# Altium schematic sheet IoT_Greenhouse V1.0 A - Inputs.SchDoc
size A4; DrawnBy: Elio F; Engineer: Elio F; Revision: A; SheetNumber: 4; SheetTotal: 5; Sheet Title: Inputs
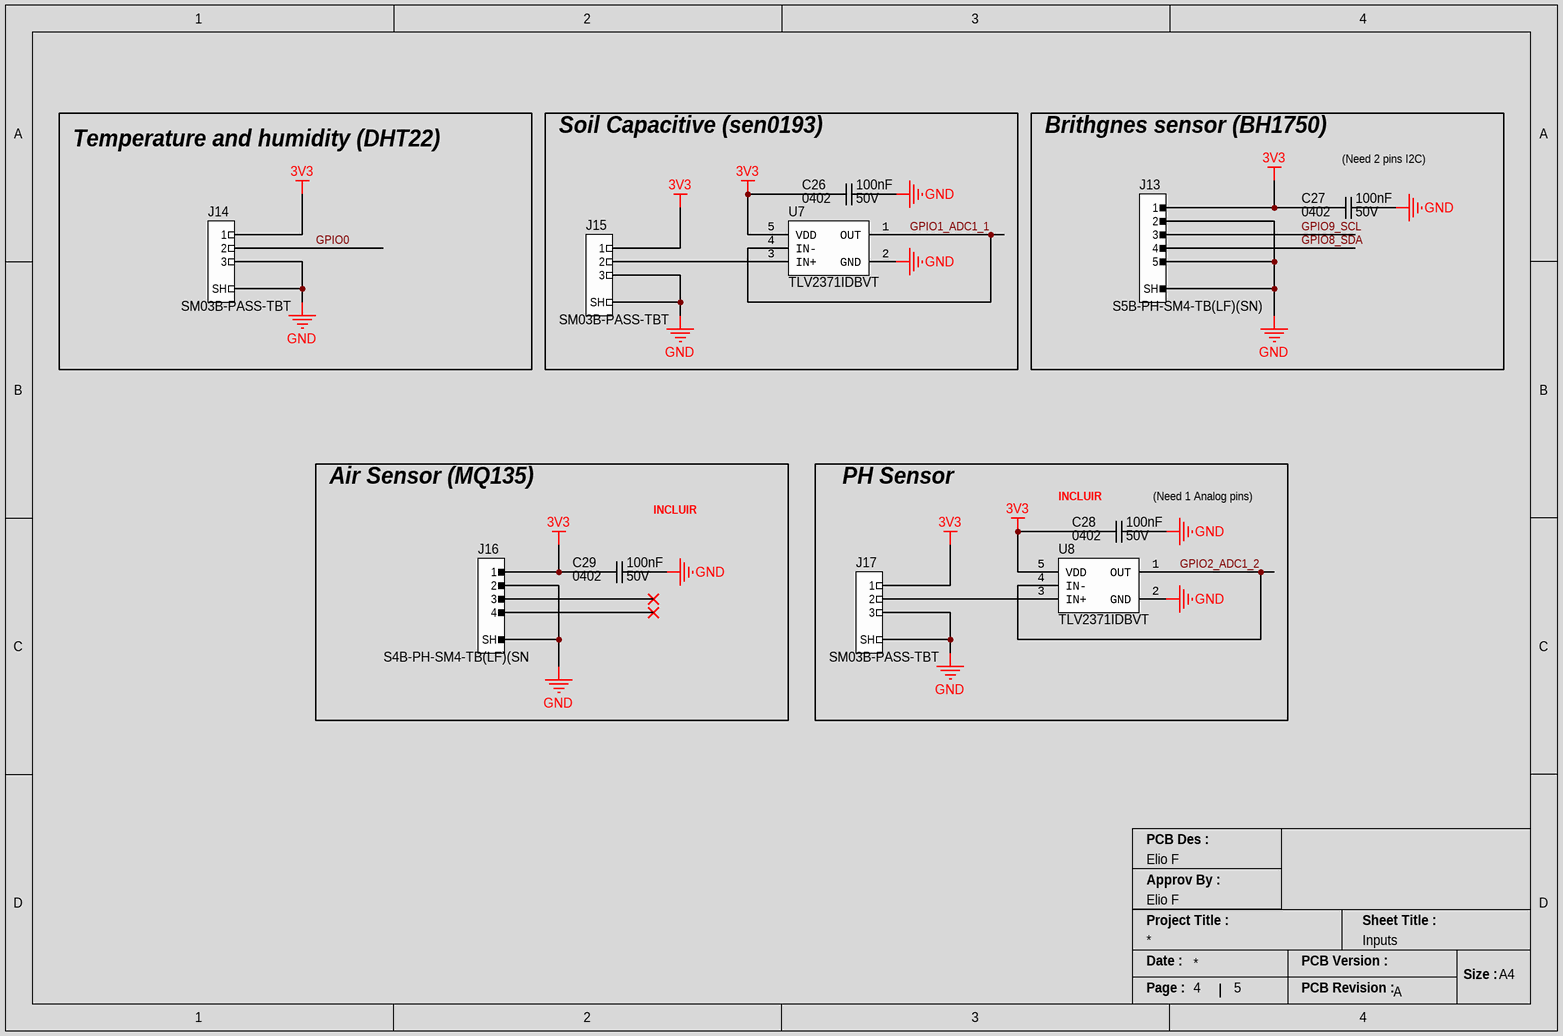
[diagram p0: IoT_Greenhouse V1.0 A - Inputs.SchDoc]

## Parts
C26  Voltage Rating: 50V  Capacitance: 100nF  Case/Package: 0402  [CAP_0402_CAPC1005X05N]  (hidden comment: GRM155R71H104KE14D)
C27  Voltage Rating: 50V  Capacitance: 100nF  Case/Package: 0402  [CAP_0402_CAPC1005X05N]  (hidden comment: GRM155R71H104KE14D)
C28  Voltage Rating: 50V  Capacitance: 100nF  Case/Package: 0402  [CAP_0402_CAPC1005X05N]  (hidden comment: GRM155R71H104KE14D)
C29  Voltage Rating: 50V  Capacitance: 100nF  Case/Package: 0402  [CAP_0402_CAPC1005X05N]  (hidden comment: GRM155R71H104KE14D)
J13  S5B-PH-SM4-TB(LF)(SN)  [CONN_JST_S5B-PH-SM4-TB_LF_SN_0]
J14  SM03B-PASS-TBT  [CONN_JST_SM03B-PASS-TBT_LF_SN_MFG]
J15  SM03B-PASS-TBT  [CONN_JST_SM03B-PASS-TBT_LF_SN_MFG]
J16  S4B-PH-SM4-TB(LF)(SN  [CONN_JST_S4B-PH-SM4-TB_LF_SN_0]
J17  SM03B-PASS-TBT  [CONN_JST_SM03B-PASS-TBT_LF_SN_MFG]
U7  TLV2371IDBVT  [IC_AMP_OP_SOT95P280X145-5N]
U8  TLV2371IDBVT  [IC_AMP_OP_SOT95P280X145-5N]

## Blocks framed on the sheet
Temperature and humidity (DHT22): J14
Soil Capacitive (sen0193): C26 J15 U7
Brithgnes sensor (BH1750): C27 J13
Air Sensor (MQ135): C29 J16
PH Sensor: C28 J17 U8

## Nets
3V3: C26.2 C27.2 C28.2 C29.2 J13.1 J14.1 J15.1 J16.1 J17.1 U7.5(VDD) U8.5(VDD)
GND: C26.1 C27.1 C28.1 C29.1 J13.0(SH) J13.2 J13.5 J14.3 J14.SH J15.3 J15.SH J16.0(SH) J16.2 J17.3 J17.SH U7.2(GND) U8.2(GND)
GPIO0: J14.2
GPIO1_ADC1_1: U7.1(OUT) U7.4(IN-)
GPIO2_ADC1_2: U8.1(OUT) U8.4(IN-)
GPIO8_SDA: J13.4
GPIO9_SCL: J13.3
NetJ15_2: J15.2 U7.3(IN+)
NetJ17_2: J17.2 U8.3(IN+)

Not connected (* = marked no-connect by the designer): J16 3* 4*

## Notes on the sheet
- (near C27) (Need 2 pins I2C)
- INCLUIR
- (near C28) INCLUIR
- (near C28) (Need 1 Analog pins)
- PCB Des :
- Approv By :
- Project Title :
- Sheet Title :
- Date :
- PCB Version :
- Size :
- A4
- Page :
- PCB Revision :

## Library data of the parts
C26-C29 = CAP_100NF_50V_X7R_0402: Multilayer Ceramic Capacitor, 0.1 uF, 16 V, ± 10%, X7R, 0402 [1005 Metric]; Manufacturer: Murata; Dissipation Factor: 0.025%; Temperature Coefficient: 30ppm/°C; Supplier 1: DigiKey; Manufacturer Part Number: GRM155R71H104KE14D; RoHS: Yes; Category: Ceramic Capacitors; Stock 1: 13730790; Pricing 1: 1=0.1, 10=0.023, 50=0.0132, 100=0.0102, 500=0.00768, 1000=0.00603, 2500=0.00548, 5000=0.00504 (USD); Mount: Surface Mount; Number of Pins: 2NUMBER; Case Code (Metric): 1005; Material: Ceramic; Case Code (Imperial): 0402; Weight: 0.000212oz; Dielectric Material: Ceramic; Min Operating Temperature: -55°C; Max Operating Temperature: 125°C; Packaging: Tape and Reel; Package Quantity: 10000; Series: GRM; Tolerance: 10%; Dielectric: X7R; Termination: SMD/SMT; Voltage: 50V; Voltage Rating (DC): 50V; Construction: Flat; Length: 1mm; Width: 0.5mm; Height: 0.5mm; Depth: 0.5mm; Thickness: 0.022inch; Reach SVHC Compliant: No; RoHS Compliant: Yes; Lead Free: 5697LeadFree; ComponentLink1URL: http://www.farnell.com/datasheets/2079156.pdf?src-supplier=Farnell; ComponentLink1Description: http://www.farnell.com/datasheets/2079156.pdf?src-supplier=Farnell; ComponentLink2URL: http://www.mouser.com/ds/2/281/c02e-2905.pdf?src-supplier=Mouser; ComponentLink2Description: http://www.mouser.com/ds/2/281/c02e-2905.pdf?src-supplier=Mouser; ComponentLink3URL: http://www.farnell.com/datasheets/2079156.pdf?src-supplier=Newark; ComponentLink3Description: http://www.farnell.com/datasheets/2079156.pdf?src-supplier=Newark; ComponentLink4URL: https://datasheet.octopart.com/GRM155R71H104KE14D-Murata-datasheet-22122223.pdf?src-supplier=Future+Electronics; ComponentLink4Description: https://datasheet.octopart.com/GRM155R71H104KE14D-Murata-datasheet-22122223.pdf?src-supplier=Future+Electronics; ComponentLink5URL: https://search.murata.co.jp/Ceramy/image/img/A01X/G101/ENG/GRM155R71H104KE14-01.pdf?src-supplier=Digi-Key; ComponentLink5Description: https://search.murata.co.jp/Ceramy/image/img/A01X/G101/ENG/GRM155R71H104KE14-01.pdf?src-supplier=Digi-Key; ComponentLink6URL: http://psearch.en.murata.com/capacitor/product/GRM155R71H104KE14%23.pdf?src-supplier=Avnet; ComponentLink6Description: http://psearch.en.murata.com/capacitor/product/GRM155R71H104KE14%23.pdf?src-supplier=Avnet; ComponentLink7URL: https://datasheet.octopart.com/GRM155R71H104KE14D-Murata-datasheet-66077078.pdf?src-supplier=Element14; ComponentLink7Description: https://datasheet.octopart.com/GRM155R71H104KE14D-Murata-datasheet-66077078.pdf?src-supplier=Element14; Supplier Part Number 1: 490-10700-6-ND; Supplier 2: Digikey; Stock 2: 3706055; Pricing 2: 1=0.1, 10=0.037, 50=0.021, 100=0.0162, 500=0.01224, 1000=0.00961, 2500=0.00874, 5000=0.00804 (USD); Halogen Free: 5694HalogenFree; ComponentLink8URL: http://www.mouser.com/ds/2/447/UPY-GPHC_X5R_4V-to-50V_25-1131599.pdf?src-supplier=Mouser; ComponentLink8Description: http://www.mouser.com/ds/2/447/UPY-GPHC_X5R_4V-to-50V_25-1131599.pdf?src-supplier=Mouser; ComponentLink9URL: https://datasheet.octopart.com/CC0402KRX5R8BB104-Yageo-datasheet-137700082.pdf?src-supplier=Future+Electronics; ComponentLink9Description: https://datasheet.octopart.com/CC0402KRX5R8BB104-Yageo-datasheet-137700082.pdf?src-supplier=Future+Electronics; ComponentLink10URL: http://www.yageo.com/documents/recent/UPY-GPHC_X5R_4V-to-50V_25.pdf?src-supplier=Digikey; ComponentLink10Description: http://www.yageo.com/documents/recent/UPY-GPHC_X5R_4V-to-50V_25.pdf?src-supplier=Digikey; ComponentLink11URL: https://datasheet.octopart.com/CC0402KRX5R8BB104-Yageo-datasheet-140260304.pdf?src-supplier=Newark; ComponentLink11Description: https://datasheet.octopart.com/CC0402KRX5R8BB104-Yageo-datasheet-140260304.pdf?src-supplier=Newark; ComponentLink12URL: https://datasheet.octopart.com/CC0402KRX5R8BB104-Yageo-datasheet-170350636.pdf?src-supplier=Future+Electronics; ComponentLink12Description: https://datasheet.octopart.com/CC0402KRX5R8BB104-Yageo-datasheet-170350636.pdf?src-supplier=Future+Electronics; ComponentLink13URL: http://www.yageo.com/documents/recent/UPY-GPHC_X5R_4V-to-50V-16.pdf?src-supplier=Future+Electronics; ComponentLink13Description: http://www.yageo.com/documents/recent/UPY-GPHC_X5R_4V-to-50V-16.pdf?src-supplier=Future+Electronics; Supplier Part Number 2: 311-1697-1-ND
J13 = CONN_JST_PH_RA_5P_2mm: Conn Shrouded Header (4 Sides) HDR 5 POS 2mm Solder RA SMD T/R; Manufacturer: JST; Contact Resistance: 20mR; Current Rating: 2A; Voltage Rating (AC): 100V; Number of Poles: 5; Insulation Resistance: 1GR; Gender: Male; Manufacturer Part Number: S5B-PH-SM4-TB(LF)(SN); RoHS: Yes; Category: Connectors; Stock 1: 35118; Pricing 1: 1=0.81000, 10=0.70600, 100=0.58210, 500=0.50618 (USD); Mount: Surface Mount; Color: Natural,White; Contact Material: Copper Alloy,Tin,Bronze,Brass; Contact Plating: Tin,Copper; Housing Color: Beige; Housing Material: Polyamide; Contact Shape: Square; Contact Finish - Mating: TIN; Insulation Material: Nylon; Insulation Color: Natural; Min Operating Temperature: -25°C; Max Operating Temperature: 85°C; Packaging: Tape and Reel; Number of Rows: 1; Fastening Type: Detent; Max Current Rating: 2A; Number of Positions: 5; Termination: Solder; Max Voltage Rating (AC): 100V; Number of Contacts: 5; Working Voltage: 100V; Orientation: Right Angle; Connector Type: Header; Series: PH; Contact Type: Male Pin; Voltage Rating: 100V; Length: 13.9mm; Width: 5mm; Height: 9.4mm; Lead Pitch: 2mm; Pitch: 2mm; Contact Mating Length: 0.13inch; Depth: 8.6mm; Reach SVHC Compliant: Yes; Lead Free: Lead Free; Flammability Rating: UL94 V-0; ComponentLink1URL: https://datasheet.ciiva.com/712/eph-712755.pdf?src-supplier=Digi-Key; ComponentLink1Description: https://datasheet.ciiva.com/712/eph-712755.pdf?src-supplier=Digi-Key; ComponentLink2URL: https://datasheet.ciiva.com/26894/getdatasheetpartid-641042-26894630.pdf?src-supplier=Verical; ComponentLink2Description: https://datasheet.ciiva.com/26894/getdatasheetpartid-641042-26894630.pdf?src-supplier=Verical; Supplier 1: Digi-Key; Supplier 2: Arrow Electronics; Supplier 3: Newark; Supplier Part Number 1: 455-1752-1-ND; Supplier Part Number 2: S5B-PH-SM4-TB(LF)(SN); Supplier Part Number 3: 38K8079
J14 J15 J17 = CONN_JST_PH_3P_2MM_SM03B-PASS-TBT: Conn Header SMD R/a 3POS 2MM; Manufacturer: JST; Supplier 1: Digikey; Manufacturer Part Number: SM03B-PASS-TBT; RoHS: No; Stock 1: 258662; Pricing 1: 1=0.78, 10=0.657, 100=0.5904, 500=0.48304, 1000=0.42938, 2000=0.40254, 3000=0.38912, 5000=0.3757, 10000=0.35692, 25000=0.34887 (USD); Supplier Part Number 1: 455-SM03B-PASS-TBTCT-ND
J16 = CONN_JST_PH_RA_4P_2mm_JLCPCB: 1x4P PH 1 Tin 2mm 4 -25℃~+85℃ 2A Copper Alloy Surface Mount SMD,P=2mm Wire To Board / Wire To Wire Connector ROHS; Manufacturer: JST; Gender: Male; Voltage Rating (AC): 100V; Number of Contacts: 4; Insulation Resistance: 1GR; Manufacturer Part Number: S4B-PH-SM4-TB(LF)(SN; RoHS: No; Category: Connectors; Color: White; Contact Material: Copper Alloy; Contact Plating: Tin; Housing Color: Natural; Housing Material: Nylon; Current Rating: 2A; Packaging: Cut Tape; Number of Rows: 1; Termination: Solder; Voltage Rating: 100V; Orientation: Right Angle; Number of Positions: 4; Length: 11.9mm; Width: 7.6mm; Height: 5.5mm; Pitch: 2mm; Reach SVHC Compliant: Yes; Lead Free: Lead Free; Flammability Rating: UL94 V-0; Supplier 1: jlcpcb; JLCPCB Part Number: C265102
U7 U8 = IC_AMP_OP_TLV2371IDBVT: Single 550-uA/channel, 3MHz, RRIO op amp 5-SOT-23 -40 to 125; Manufacturer: Texas Instruments; Max Supply Voltage: 16V; Min Supply Voltage: 2.7V; Min Dual Supply Voltage: 1.35V; Max Dual Supply Voltage: 8V; Voltage Gain: 110dB; Common Mode Rejection Ratio: 50dB; Output Current: 16mA; Number of Channels: 1; Slew Rate: 2.4V/µs; Max I/O Voltage: 4.5mV; Input Bias Current: 60pA; Operating Supply Current: 750uA; Power Dissipation: 385mW; Power Supply Rejection Ratio (PSRR): 70dB; Amplifier Type: GENERAL PURPOSE; Supply Current: 900uA; Dual Supply Voltage: 5V; Supplier 1: Digikey; Manufacturer Part Number: TLV2371IDBVT; RoHS: Yes; Category: Amplifiers - Op Amps, Buffer, Instrumentation; Stock 1: 25753; Pricing 1: 1=1.65, 10=1.483, 25=1.3988, 100=1.1918 (USD); Case/Package: SOT-23; Number of Pins: 5; Min Operating Temperature: -40°C; Max Operating Temperature: 125°C; Gain Bandwidth Product: 3MHz; Unity Gain Bandwidth Product: 3MHz; Packaging: Tape and Reel; Bandwidth: 3MHz; Operating Supply Voltage: 8V; Package Quantity: 1; Nominal Gain Bandwidth Product: 3MHz; Number of Circuits: 1; Input Offset Voltage (Vos): 4.5mV; Output Current per Channel: 16mA; Number of Elements: 1; Series: -; Number of Amplifiers: 1; Length: 2.9mm; Width: 1.6mm; Height: 1.15mm; Radiation Hardening: No; Lead Free: Lead Free; RoHS Compliant: Yes; Reach SVHC Compliant: No; ComponentLink1URL: https://datasheet.ciiva.com/34301/1096243-34301979.pdf?src-supplier=Jameco; ComponentLink1Description: https://datasheet.ciiva.com/34301/1096243-34301979.pdf?src-supplier=Jameco; ComponentLink2URL: https://datasheet.ciiva.com/1813/tlv2370-1813657.pdf?src-supplier=Digikey; ComponentLink2Description: https://datasheet.ciiva.com/1813/tlv2370-1813657.pdf?src-supplier=Digikey; ComponentLink3URL: https://datasheet.ciiva.com/1813/tlv2370-1813658.pdf?src-supplier=Digikey; ComponentLink3Description: https://datasheet.ciiva.com/1813/tlv2370-1813658.pdf?src-supplier=Digikey; ComponentLink4URL: https://datasheet.ciiva.com/1813/tlv2370-1813659.pdf?src-supplier=Digikey; ComponentLink4Description: https://datasheet.ciiva.com/1813/tlv2370-1813659.pdf?src-supplier=Digikey; ComponentLink5URL: https://datasheet.ciiva.com/2974/slos270d-2974406.pdf?src-supplier=Avnet; ComponentLink5Description: https://datasheet.ciiva.com/2974/slos270d-2974406.pdf?src-supplier=Avnet; ComponentLink6URL: https://datasheet.ciiva.com/2974/slos270d-2974407.pdf?src-supplier=Avnet; ComponentLink6Description: https://datasheet.ciiva.com/2974/slos270d-2974407.pdf?src-supplier=Avnet; ComponentLink7URL: https://datasheet.ciiva.com/22707/1877122-22707949.pdf?src-supplier=Element14; ComponentLink7Description: https://datasheet.ciiva.com/22707/1877122-22707949.pdf?src-supplier=Element14; ComponentLink8URL: https://datasheet.ciiva.com/46386/1877122-46386527.pdf?src-supplier=Element14; ComponentLink8Description: https://datasheet.ciiva.com/46386/1877122-46386527.pdf?src-supplier=Element14; ComponentLink9URL: https://datasheet.ciiva.com/7848/1877122-7848285.pdf?src-supplier=Element14; ComponentLink9Description: https://datasheet.ciiva.com/7848/1877122-7848285.pdf?src-supplier=Element14; Supplier Part Number 1: 296-26785-6-ND